# Altium schematic sheet pca10090_sheet4_interface_mcu.SchDoc: PCA10090 - Interface MCU
size A3; Organization: Nordic Semiconductor; DocumentNumber: 4; SheetNumber: 4; SheetTotal: 8; CompanyName: Nordic Semiconductor; DocumentSize: A3
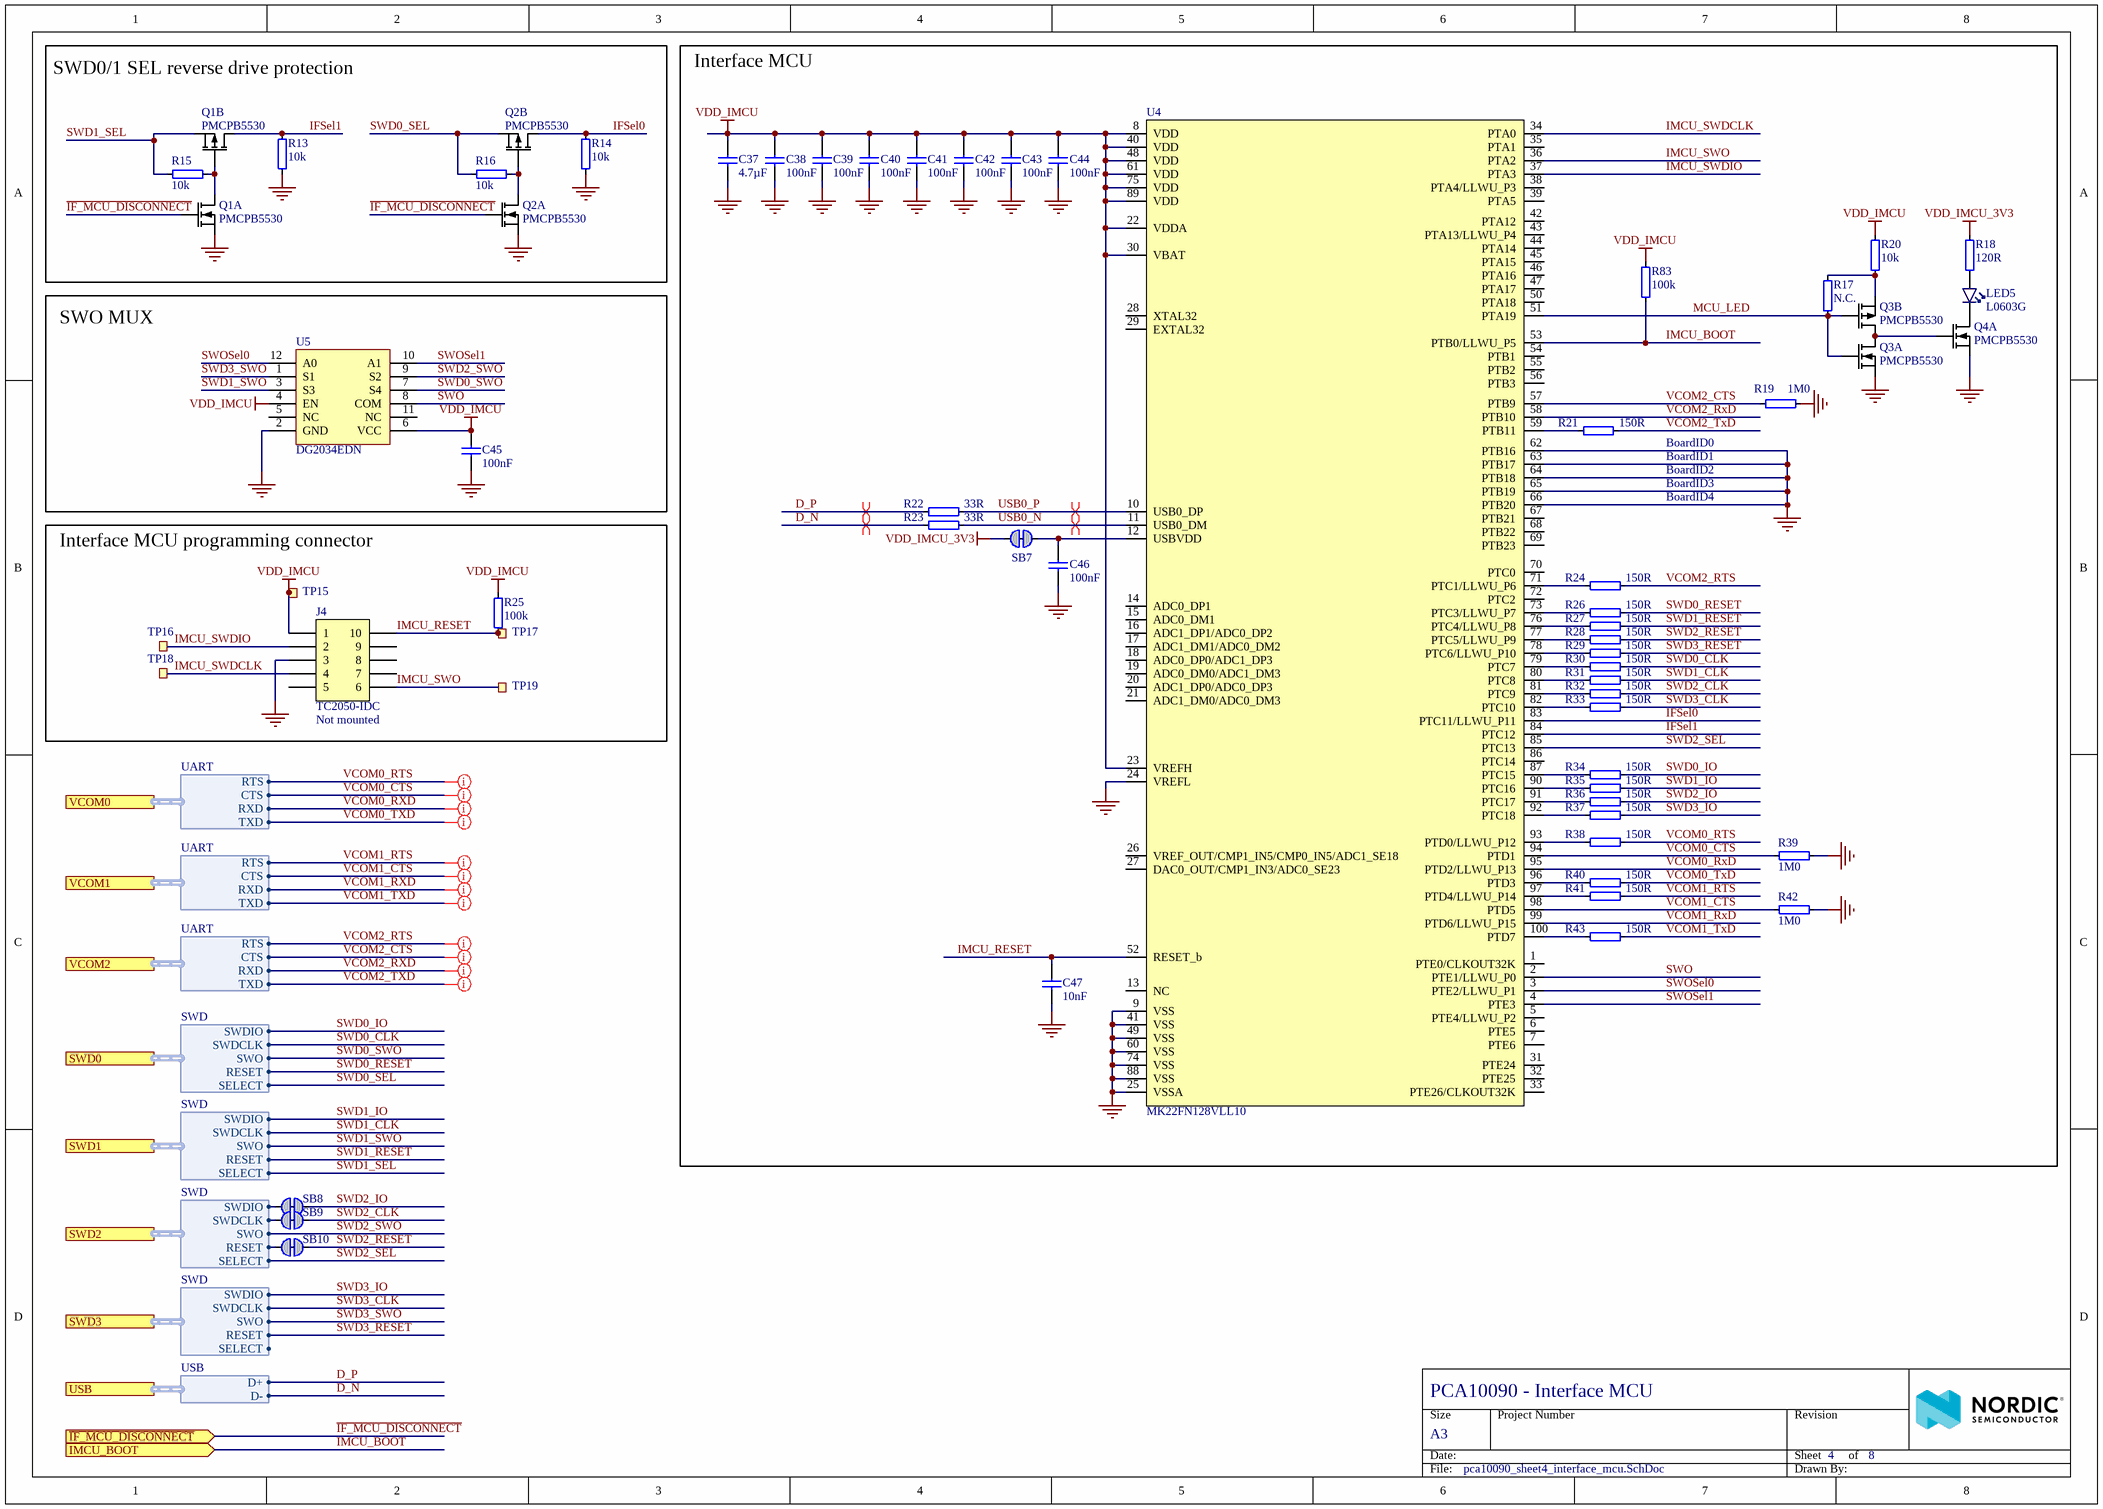
[diagram p0: pca10090_sheet4_interface_mcu.SchDoc]

## Parts
C37  4.7µF  [CAPC1005X04L]
C38  100nF  [CAPC0603X03L_C]
C39  100nF  [CAPC0603X03L_C]
C40  100nF  [CAPC0603X03L_C]
C41  100nF  [CAPC0603X03L_C]
C42  100nF  [CAPC0603X03L_C]
C43  100nF  [CAPC0603X03L_C]
C44  100nF  [CAPC0603X03L_C]
C45  100nF  [CAPC0603X03L_C]
C46  100nF  [CAPC0603X03L_C]
C47  10nF  [CAPC0603X03L_C]
J4  TC2050-IDC  Assembly: Not mounted  [TC2050-IDC-NLFP]  (no BOM)
LED5  L0603G  [LED_0603_G]
Q1  PMCPB5530  [PMCPB5530X]  (parts A,B of 2)
Q2  PMCPB5530  [PMCPB5530X]  (parts A,B of 2)
Q3  PMCPB5530  [PMCPB5530X]  (parts A,B of 2)
Q4  PMCPB5530  [PMCPB5530X]  (part A of 2)
R13  10k  [RESC0603X03L_C]
R14  10k  [RESC0603X03L_C]
R15  10k  [RESC0603X03L_C]
R16  10k  [RESC0603X03L_C]
R17  N.C.  [RESC0603X03L_C_NC]
R18  120R  [RESC0603X03L_C]
R19  1M0  [RESC0603X03L_C]
R20  10k  [RESC0603X03L_C]
R21  150R  [RESC0603X03L_C]
R22  33R  [RESC0603X03L_C]
R23  33R  [RESC0603X03L_C]
R24  150R  [RESC0603X03L_C]
R25  100k  [RESC0603X03L_C]
R26  150R  [RESC0603X03L_C]
R27  150R  [RESC0603X03L_C]
R28  150R  [RESC0603X03L_C]
R29  150R  [RESC0603X03L_C]
R30  150R  [RESC0603X03L_C]
R31  150R  [RESC0603X03L_C]
R32  150R  [RESC0603X03L_C]
R33  150R  [RESC0603X03L_C]
R34  150R  [RESC0603X03L_C]
R35  150R  [RESC0603X03L_C]
R36  150R  [RESC0603X03L_C]
R37  150R  [RESC0603X03L_C]
R38  150R  [RESC0603X03L_C]
R39  1M0  [RESC0603X03L_C]
R40  150R  [RESC0603X03L_C]
R41  150R  [RESC0603X03L_C]
R42  1M0  [RESC0603X03L_C]
R43  150R  [RESC0603X03L_C]
R83  100k  [RESC0603X03L_C]
SB7  Solderbridge  [Solderbridge_Shorted]  (value not drawn)  (net tie, no BOM)
SB8  Solderbridge  [Solderbridge_Shorted]  (value not drawn)  (net tie, no BOM)
SB9  Solderbridge  [Solderbridge_Shorted]  (value not drawn)  (net tie, no BOM)
SB10  Solderbridge  [Solderbridge_Shorted]  (value not drawn)  (net tie, no BOM)
TP15  Ø1.5mm,SMD  [TP_SMD_Ø1.5mm]  (value not drawn)  (no BOM)
TP16  Ø1.5mm,SMD  [TP_SMD_Ø1.5mm]  (value not drawn)  (no BOM)
TP17  Ø1.5mm,SMD  [TP_SMD_Ø1.5mm]  (value not drawn)  (no BOM)
TP18  Ø1.5mm,SMD  [TP_SMD_Ø1.5mm]  (value not drawn)  (no BOM)
TP19  Ø1.5mm,SMD  [TP_SMD_Ø1.5mm]  (value not drawn)  (no BOM)
U4  MK22FN128VLL10  [TSQFP50P1600X1600X160-100N]
U5  DG2034EDN  [DG2034EDN]

## Blocks framed on the sheet
SWD0/1 SEL reverse drive protection: Q1 Q2 R13-R16
Interface MCU: C37-C44 C46 C47 LED5 Q3 Q4 R17-R24 R26-R43 R83 SB7 U4
SWO MUX: C45 U5
Interface MCU programming connector: J4 R25 TP15-TP19

## Ports
IMCU_BOOT (in), SWD0 (harness SWD), SWD1 (harness SWD), SWD2 (harness SWD), SWD3 (harness SWD), USB (harness USB), VCOM0 (harness UART), VCOM1 (harness UART), VCOM2 (harness UART), ~{IF_MCU_DISCONNECT} (in)

## Harnesses
UART: RTS, CTS, RXD, TXD
SWD: SWDIO, SWDCLK, SWO, RESET, SELECT
USB: D+, D-

## Nets
GND: C37.2 C38.1 C39.1 C40.2 C41.1 C42.1 C43.1 C44.1 C45.2 C46.2 C47.1 J4.3 Q1.1(S1) Q2.1(S1) Q3.1(S1) Q4.1(S1) R13.1 R14.2 R19.2 R39.2 R42.2 U4.9(VSS) U4.24(VREFL) U4.25(VSSA) U4.41(VSS) U4.49(VSS) U4.60(VSS) U4.62(PTB16) U4.63(PTB17) U4.64(PTB18) U4.65(PTB19) U4.66(PTB20) U4.74(VSS) U4.88(VSS) U5.2(GND)
VDD_IMCU: C37.1 C38.2 C39.2 C40.1 C41.2 C42.2 C43.2 C44.2 C45.1 J4.1 R20.1 R25.2 R83.2 TP15.1 U4.8(VDD) U4.22(VDDA) U4.23(VREFH) U4.30(VBAT) U4.40(VDD) U4.48(VDD) U4.61(VDD) U4.75(VDD) U4.89(VDD) U5.4(EN) U5.6(VCC)
VDD_IMCU_3V3: R18.2 SB7.2
D_N: R23.1 ; port USB.D-
D_P: R22.1 ; port USB.D+
~{IF_MCU_DISCONNECT}: Q1.2(G1) Q2.2(G1) ; port ~{IF_MCU_DISCONNECT}
IFSel0: Q2.3(D2) R14.1 U4.83(PTC11/LLWU_P11)
IFSel1: Q1.3(D2) R13.2 U4.84(PTC12)
IMCU_BOOT: R83.1 U4.53(PTB0/LLWU_P5) ; port IMCU_BOOT
IMCU_RESET: C47.2 J4.10 R25.1 TP17.1 U4.52(RESET_b)
IMCU_SWDCLK: J4.4 TP18.1 U4.34(PTA0)
IMCU_SWDIO: J4.2 TP16.1 U4.37(PTA3)
IMCU_SWO: J4.6 TP19.1 U4.36(PTA2)
MCU_LED: Q3.2(G1) Q3.5(G2) R17.1 U4.51(PTA19)
SWD0_CLK: R30.2 ; port SWD0.SWDCLK
SWD0_IO: R34.2 ; port SWD0.SWDIO
SWD0_RESET: R26.2 ; port SWD0.RESET
SWD0_SEL: Q2.4(S2) R16.2 ; port SWD0.SELECT
SWD0_SWO: U5.7(S4) ; port SWD0.SWO
SWD1_CLK: R31.2 ; port SWD1.SWDCLK
SWD1_IO: R35.2 ; port SWD1.SWDIO
SWD1_RESET: R27.2 ; port SWD1.RESET
SWD1_SEL: Q1.4(S2) R15.1 ; port SWD1.SELECT
SWD1_SWO: U5.3(S3) ; port SWD1.SWO
SWD2_CLK: R32.2 SB9.2
SWD2_IO: R36.2 SB8.2
SWD2_RESET: R28.2 SB10.2
SWD2_SEL: U4.85(PTC13) ; port SWD2.SELECT
SWD2_SWO: U5.9(S2) ; port SWD2.SWO
SWD3_CLK: R33.2 ; port SWD3.SWDCLK
SWD3_IO: R37.2 ; port SWD3.SWDIO
SWD3_RESET: R29.2 ; port SWD3.RESET
SWD3_SWO: U5.1(S1) ; port SWD3.SWO
SWO: U4.2(PTE1/LLWU_P0) U5.8(COM)
SWOSel0: U4.3(PTE2/LLWU_P1) U5.12(A0)
SWOSel1: U4.4(PTE3) U5.10(A1)
USB0_N: R23.2 U4.11(USB0_DM)
USB0_P: R22.2 U4.10(USB0_DP)
VCOM0_CTS: R39.1 U4.94(PTD1) ; port VCOM0.CTS
VCOM0_RTS: R38.2 ; port VCOM0.RTS
VCOM0_RxD: U4.95(PTD2/LLWU_P13) ; port VCOM0.RXD
VCOM0_TxD: R40.2 ; port VCOM0.TXD
VCOM1_CTS: R42.1 U4.98(PTD5) ; port VCOM1.CTS
VCOM1_RTS: R41.2 ; port VCOM1.RTS
VCOM1_RxD: U4.99(PTD6/LLWU_P15) ; port VCOM1.RXD
VCOM1_TxD: R43.2 ; port VCOM1.TXD
VCOM2_CTS: R19.1 U4.57(PTB9) ; port VCOM2.CTS
VCOM2_RTS: R24.2 ; port VCOM2.RTS
VCOM2_RxD: U4.58(PTB10) ; port VCOM2.RXD
VCOM2_TxD: R21.2 ; port VCOM2.TXD
NetC46_1: C46.1 SB7.1 U4.12(USBVDD)
NetLED5_1: LED5.1(C) Q4.6(D1)
NetLED5_2: LED5.2(A) R18.1
NetQ1_5: Q1.5(G2) Q1.6(D1) R15.2
NetQ2_5: Q2.5(G2) Q2.6(D1) R16.1
NetQ3_3: Q3.3(D2) Q3.6(D1) Q4.2(G1)
NetQ3_4: Q3.4(S2) R17.2 R20.2
NetR21_1: R21.1 U4.59(PTB11)
NetR24_1: R24.1 U4.71(PTC1/LLWU_P6)
NetR26_1: R26.1 U4.73(PTC3/LLWU_P7)
NetR27_1: R27.1 U4.76(PTC4/LLWU_P8)
NetR28_1: R28.1 U4.77(PTC5/LLWU_P9)
NetR29_1: R29.1 U4.78(PTC6/LLWU_P10)
NetR30_1: R30.1 U4.79(PTC7)
NetR31_1: R31.1 U4.80(PTC8)
NetR32_1: R32.1 U4.81(PTC9)
NetR33_1: R33.1 U4.82(PTC10)
NetR34_1: R34.1 U4.87(PTC15)
NetR35_1: R35.1 U4.90(PTC16)
NetR36_1: R36.1 U4.91(PTC17)
NetR37_1: R37.1 U4.92(PTC18)
NetR38_1: R38.1 U4.93(PTD0/LLWU_P12)
NetR40_1: R40.1 U4.96(PTD3)
NetR41_1: R41.1 U4.97(PTD4/LLWU_P14)
NetR43_1: R43.1 U4.100(PTD7)
NetSB8_1: SB8.1 ; port SWD2.SWDIO
NetSB9_1: SB9.1 ; port SWD2.SWDCLK
NetSB10_1: SB10.1 ; port SWD2.RESET

Not connected (* = marked no-connect by the designer): J4 5 7 8 9; U4 1(PTE0/CLKOUT32K) 5(PTE4/LLWU_P2) 6(PTE5) 7(PTE6) 13(NC) 14(ADC0_DP1) 15(ADC0_DM1) 16(ADC1_DP1/ADC0_DP2) 17(ADC1_DM1/ADC0_DM2) 18(ADC0_DP0/ADC1_DP3) 19(ADC0_DM0/ADC1_DM3) 20(ADC1_DP0/ADC0_DP3) 21(ADC1_DM0/ADC0_DM3) 26(VREF_OUT/CMP1_IN5/CMP0_IN5/ADC1_SE18) 27(DAC0_OUT/CMP1_IN3/ADC0_SE23) 28(XTAL32) 29(EXTAL32) 31(PTE24) 32(PTE25) 33(PTE26/CLKOUT32K) 35(PTA1) 38(PTA4/LLWU_P3) 39(PTA5) 42(PTA12) 43(PTA13/LLWU_P4) 44(PTA14) 45(PTA15) 46(PTA16) 47(PTA17) 50(PTA18) 54(PTB1) 55(PTB2) 56(PTB3) 67(PTB21) 68(PTB22) 69(PTB23) 70(PTC0) 72(PTC2) 86(PTC14); U5 5(NC) 11(NC)

## Layout directives
differential pair: D_N, D_P, USB0_N, USB0_P
net class UART: VCOM0_CTS, VCOM0_RTS, VCOM0_RxD, VCOM0_TxD, VCOM1_CTS, VCOM1_RTS, VCOM1_RxD, VCOM1_TxD, VCOM2_CTS, VCOM2_RTS, VCOM2_RxD, VCOM2_TxD

## Notes on the sheet
- BoardID0
- BoardID1
- BoardID2
- BoardID3
- BoardID4
- Size
- Date:
- A3
- Project Number
- Sheet         of
- Revision
- File:
- Drawn By:

## Library data of the parts
C37 = C0402-4µ7: Capacitor, X5R, ±20%; Part number IPS: 00000001251, 00000007165; Note: 10V; Artikkelnr Noca: 20039482; Part Number: C0402-4µ7; Manufacturer: *; Manufacturer Part Number: *; ComponentLink1URL: *; ComponentLink1Description: Datasheet; ComponentLink2URL: *; ComponentLink2Description: Supplier link; HelpURL: *; Footprint Doc: 0402; LatestRevisionDate: 2017-11-09; Pin Count: 2; Publisher: Nordic Semiconductor; Published: 2009-05-08; Value: 4.7µF; Supplier 1: Digi-Key; Supplier Part Number 1: 490-13252-1-ND; Supplier 2: *; Supplier Part Number 2: *
C38-C46 = C0201-100n: Capacitor, X5R, ±10%; Part number IPS: 00000001248, 00000002505; Note: 16V; Artikkelnr Noca: N.A.; Part Number: C0201-100n; Manufacturer: *; Manufacturer Part Number: *; ComponentLink1URL: *; ComponentLink1Description: Datasheet; ComponentLink2URL: *; ComponentLink2Description: Supplier link; HelpURL: *; Footprint Doc: 0201; LatestRevisionDate: 2017-11-09; Pin Count: 2; Publisher: Nordic Semiconductor; Published: 2014-11-13; Value: 100nF; Supplier 1: *; Supplier Part Number 1: *; Supplier 2: *; Supplier Part Number 2: *
C47 = C0201-10n: Capacitor, X7R, ±10%; Part number IPS: 00000003480; Note: 10V; Artikkelnr Noca: N.A.; Part Number: C0201-10n; Manufacturer: *; Manufacturer Part Number: *; ComponentLink1URL: *; ComponentLink1Description: Datasheet; ComponentLink2URL: *; ComponentLink2Description: Supplier link; HelpURL: *; Footprint Doc: 0201; LatestRevisionDate: 2017-11-09; Pin Count: 2; Publisher: Nordic Semiconductor; Published: 2014-11-13; Value: 10nF; Supplier 1: *; Supplier Part Number 1: *; Supplier 2: *; Supplier Part Number 2: *
J4 = TC2050-IDC-NLFP: CBL PLUG-OF-NAILS 10-PIN; Manufacturer: Tag-Connect LLC; Artikkelnr Noca: N.A.; Part Number: TC2050-IDC-NLFP; Manufacturer Part Number: TC2050-IDC-NLFP; LatestRevisionDate: 2012-11-21; Publisher: Nordic Semiconductor; Published: 2012-11-21; Value: TC2050-IDC; Pin Count: 10; Footprint Doc: TC2050-IDC-NLFP; Part number IPS: N.A.; ComponentLink1URL: *; ComponentLink1Description: Datasheet; ComponentLink2URL: *; ComponentLink2Description: Supplier link; HelpURL: http://www.tag-connect.com/Materials/TC2050-IDC%20Datasheet.pdf; Supplier 1: Digi-Key; Supplier Part Number 1: TC2050-IDC-NL-ND; Supplier 2: *; Supplier Part Number 2: *
LED5 = VS 25C7M5: LED, Green, 0603, 573nm, Vf=2.0V, 24mcd, - 40 to +85°C; Manufacturer: Victory Electronics; Part number IPS: N.A.; Artikkelnr Noca: 13019193; Part Number: VS 25C7M5; Manufacturer Part Number: VS 25C7M5; Footprint Doc: 0603; LatestRevisionDate: 2017-08-21; Pin Count: 2; Publisher: Nordic Semiconductor; Published: 2017-08-21; Value: L0603G; Note: *; ComponentLink1URL: *; ComponentLink1Description: Datasheet; ComponentLink2URL: *; ComponentLink2Description: Supplier link; HelpURL: \\hizz\pro\app9717\Datasheet\optoelectronics\Victory Electronics\VS 25C7M5.pdf; Supplier 1: EC Partner; Supplier Part Number 1: *; Supplier 2: *; Supplier Part Number 2: *
Q1-Q4 = PMCPB5530X,115: Mosfet Array N and P-Channel 20V 4A (Ta), 3.4A (Ta) 490mW Surface Mount 6-HUSON-EP (2x2); Manufacturer: Nexperia; Part number IPS: 00000001918; Artikkelnr Noca: N.A.; Part Number: PMCPB5530X,115; Manufacturer Part Number: PMCPB5530X,115; ComponentLink1URL: https://assets.nexperia.com/documents/data-sheet/PMCPB5530X.pdf; ComponentLink1Description: Datasheet; ComponentLink2URL: https://www.digikey.com/product-detail/en/nexperia-usa-inc/PMCPB5530X115/1727-1327-1-ND/4386339; ComponentLink2Description: Supplier link; HelpURL: https://www.nexperia.com/products/mosfets/small-signal-mosfets/PMCPB5530X.html; Footprint Doc: 6-UDFN; LatestRevisionDate: 2018-04-30; Pin Count: 8; Publisher: Nordic Semiconductor; Published: 2018-04-30; Value: PMCPB5530; Note: *; Supplier 1: Digi-Key; Supplier Part Number 1: 1727-1327-1-ND; Supplier 2: Mouser; Supplier Part Number 2: 771-PMCPB5530X115
R13-R16 R20 = R0201-10k: Resistor, ±1%, 0.05W; Part number IPS: 00000001255; Note: Chip Res 1%; Artikkelnr Noca: N.A.; Part Number: R0201-10k; Manufacturer: *; Manufacturer Part Number: *; ComponentLink1URL: *; ComponentLink1Description: Datasheet; ComponentLink2URL: *; ComponentLink2Description: Supplier link; HelpURL: *; Footprint Doc: 0201; LatestRevisionDate: 2014-11-13; Pin Count: 2; Publisher: Nordic Semiconductor; Published: 2014-11-13; Value: 10k; Supplier 1: *; Supplier Part Number 1: *; Supplier 2: *; Supplier Part Number 2: *
R17 = R0201-N.C.: Not mounted; Note: Chip Res; Artikkelnr Noca: N.A.; Assembly: Not mounted; Part Number: R0201-N.C.; Manufacturer: *; Manufacturer Part Number: *; ComponentLink1URL: *; ComponentLink1Description: Datasheet; ComponentLink2URL: *; ComponentLink2Description: Supplier link; HelpURL: *; Footprint Doc: 0201; LatestRevisionDate: 2014-11-13; Pin Count: 2; Publisher: Nordic Semiconductor; Published: 2014-11-13; Value: N.C.; Supplier 1: *; Supplier Part Number 1: *; Supplier 2: *; Supplier Part Number 2: *; Part number IPS: N.A.
R18 = R0201-120: Resistor, ±1%, 0.05W; Part number IPS: 00000000880; Note: Chip Res 1%; Artikkelnr Noca: N.A.; Part Number: R0201-120; Manufacturer: *; Manufacturer Part Number: *; ComponentLink1URL: *; ComponentLink1Description: Datasheet; ComponentLink2URL: *; ComponentLink2Description: Supplier link; HelpURL: *; Footprint Doc: 0201; LatestRevisionDate: 2014-11-13; Pin Count: 2; Publisher: Nordic Semiconductor; Published: 2014-11-13; Value: 120R; Supplier 1: *; Supplier Part Number 1: *; Supplier 2: *; Supplier Part Number 2: *
R19 R39 R42 = R0201-1M0: Resistor, ±1%, 0.05W; Part number IPS: 00000001418; Note: Chip Res 1%; Artikkelnr Noca: N.A.; Part Number: R0201-1M0; Manufacturer: *; Manufacturer Part Number: *; ComponentLink1URL: *; ComponentLink1Description: Datasheet; ComponentLink2URL: *; ComponentLink2Description: Supplier link; HelpURL: *; Footprint Doc: 0201; LatestRevisionDate: 2014-11-13; Pin Count: 2; Publisher: Nordic Semiconductor; Published: 2014-11-13; Value: 1M0; Supplier 1: *; Supplier Part Number 1: *; Supplier 2: *; Supplier Part Number 2: *
R21 R24 R26-R38 R40 R41 R43 = R0201-150: Resistor, ±1%, 0.05W; Part number IPS: 00000001420; Note: Chip Res 1%; Artikkelnr Noca: N.A.; Part Number: R0201-150; Manufacturer: *; Manufacturer Part Number: *; ComponentLink1URL: *; ComponentLink1Description: Datasheet; ComponentLink2URL: *; ComponentLink2Description: Supplier link; HelpURL: *; Footprint Doc: 0201; LatestRevisionDate: 2014-11-13; Pin Count: 2; Publisher: Nordic Semiconductor; Published: 2014-11-13; Value: 150R; Supplier 1: *; Supplier Part Number 1: *; Supplier 2: *; Supplier Part Number 2: *
R22 R23 = R0201-33R: Resistor, ±1%, 0.05W; Part number IPS: 00000003623; Note: Chip Res 1%; Artikkelnr Noca: N.A.; Part Number: R0201-33R; Manufacturer: *; Manufacturer Part Number: *; ComponentLink1URL: *; ComponentLink1Description: Datasheet; ComponentLink2URL: *; ComponentLink2Description: Supplier link; HelpURL: *; Footprint Doc: 0201; LatestRevisionDate: 2014-11-13; Pin Count: 2; Publisher: Nordic Semiconductor; Published: 2014-11-13; Value: 33R; Supplier 1: *; Supplier Part Number 1: *; Supplier 2: *; Supplier Part Number 2: *
R25 R83 = R0201-100k: Resistor, ±1%, 0.05W; Part number IPS: 00000001419; Note: Chip Res 1%; Artikkelnr Noca: N.A.; Part Number: R0201-100k; Manufacturer: *; Manufacturer Part Number: *; ComponentLink1URL: *; ComponentLink1Description: Datasheet; ComponentLink2URL: *; ComponentLink2Description: Supplier link; HelpURL: *; Footprint Doc: 0201; LatestRevisionDate: 2014-11-13; Pin Count: 2; Publisher: Nordic Semiconductor; Published: 2014-11-13; Value: 100k; Supplier 1: *; Supplier Part Number 1: *; Supplier 2: *; Supplier Part Number 2: *
SB7-SB10 = Solderbridge Shorted: Shorted Solderbridge; Artikkelnr Noca: N.A.; Part Number: Solderbridge Shorted; Manufacturer: *; Manufacturer Part Number: *; ComponentLink1URL: *; ComponentLink1Description: Datasheet; ComponentLink2URL: *; ComponentLink2Description: Supplier link; HelpURL: *; Footprint Doc: Solderbridge_Shorted; LatestRevisionDate: 2012-08-07; Pin Count: 2; Publisher: Nordic Semiconductor; Published: 2012-08-07; Value: Solderbridge; Note: *; Supplier 1: *; Supplier Part Number 1: *; Supplier 2: *; Supplier Part Number 2: *; Part number IPS: N.A.
TP15-TP19 = TP_SMD_Ø1.5MM: 1.5mm circular SMD testpad; Manufacturer: Nordic Semiconductor; Artikkelnr Noca: N.A.; Part Number: TP_SMD_Ø1.5MM; Manufacturer Part Number: *; ComponentLink1URL: *; ComponentLink1Description: Datasheet; ComponentLink2URL: *; ComponentLink2Description: Supplier link; HelpURL: *; Footprint Doc: TP_SMD_Ø1.5mm; LatestRevisionDate: 2016-06-02; Pin Count: 1; Publisher: Nordic Semiconductor; Published: 2016-06-02; Value: Ø1.5mm,SMD; Note: *; Part number IPS: N.A.; Supplier 1: *; Supplier Part Number 1: *; Supplier 2: *; Supplier Part Number 2: *
U4 = MK22FN128VLL10: 100MHz Cortex-M4F Performance MCU, 128kB Flash, 24kB SRAM, Full-Speed USB; Manufacturer: NXP; Part number IPS: 00000001366; Artikkelnr Noca: N.A.; Part Number: MK22FN128VLL10; Manufacturer Part Number: MK22FN128VLL10; ComponentLink1URL: http://cache.freescale.com/files/microcontrollers/doc/data_sheet/K22P121M100SF9.pdf; ComponentLink1Description: Datasheet; ComponentLink2URL: https://cache.nxp.com/docs/en/package-information/98ASS23308W.pdf; ComponentLink2Description: Supplier link; HelpURL: *; Footprint Doc: LQFP-100; LatestRevisionDate: 2019-03-01; Pin Count: 100; Publisher: Nordic Semiconductor; Published: 2018-05-10; Value: MK22FN128VLL10; Note: *; Supplier 1: Digi-Key; Supplier Part Number 1: MK22FN128VLL10-ND; Supplier 2: Mouser; Supplier Part Number 2: 841-MK22FN128VLL10
U5 = DG2034EDN: POWER DOWN FAULT PROTECTED,1.8VT; Manufacturer: Vishay Siliconix; Manufacturer Part Number: DG2034EDN-T1-GE4; Part number IPS: 00000001429; Artikkelnr Noca: N.A.; Part Number: DG2034EDN; ComponentLink1URL: http://www.vishay.com/docs/73172/dg2034e.pdf; ComponentLink1Description: Datasheet; ComponentLink2Description: Supplier link; Footprint Doc: 12-QFN; LatestRevisionDate: 2018-05-30; Pin Count: 12; Publisher: Nordic Semiconductor; Published: 2018-05-30; Value: DG2034EDN; Note: *; Supplier 1: Digi-Key; Supplier Part Number 1: DG2034EDN-T1-GE4CT-ND; Supplier 2: Mouser; Supplier Part Number 2: 78-DG2034EDN-T1-GE4